# EAGLE design V2 (EAGLE 9.6.2)
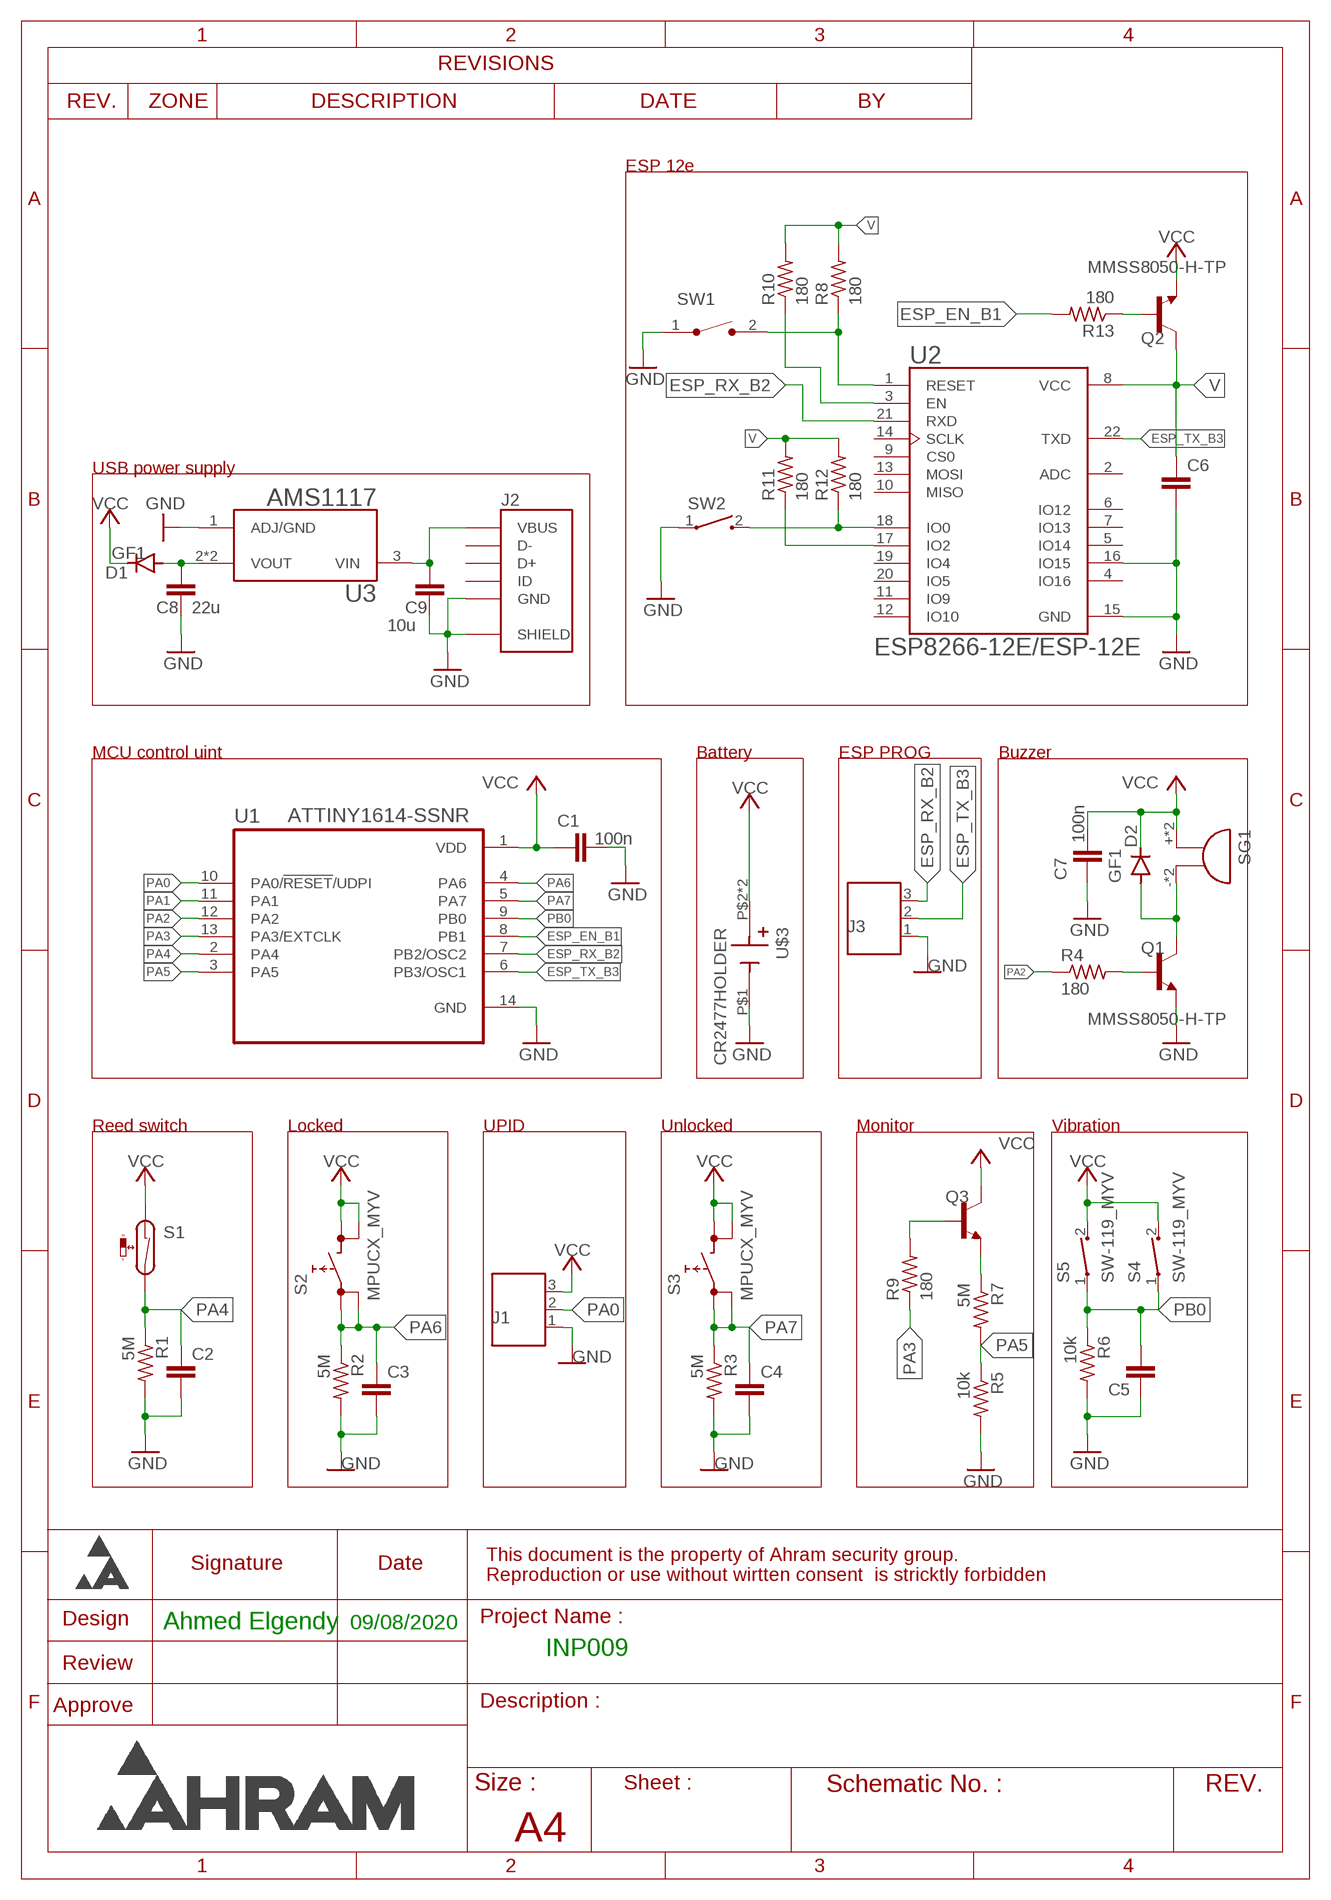
[diagram p0: schematic, sheet 1]

## Parts
C1  100n  C-EUC0805K  [C0805K]
C2  C-EUC0805K  [C0805K]
C3  C-EUC0805K  [C0805K]
C4  C-EUC0805K  [C0805K]
C5  C-EUC0805K  [C0805K]
C6  C-EUC0805K  [C0805K]
C7  100n  C-EUC0805K  [C0805K]
C8  22u  C-EUC0805K  [C0805K]
C9  10u  C-EUC0805K  [C0805K]
D1  GF1  [SMA-DO214AC]
D2  GF1  [SMA-DO214AC]
J1  691508110303  [691508110303]
J2  USB3065-XX-00-A_REVE  [GCT_USB3065-XX-00-A_REVE]
J3  691508110303  [691508110303]
Q1  MMSS8050-H-TP  [TRANS_MMSS8050-H-TP]
Q2  MMSS8050-H-TP  [TRANS_MMSS8050-H-TP]
Q3  MMSS8050-H-TP  [TRANS_MMSS8050-H-TP]
R1  5M  R-US_M0805  [M0805]
R2  5M  R-US_M0805  [M0805]
R3  5M  R-US_M0805  [M0805]
R4  180  R-US_M0805  [M0805]
R5  10k  R-US_M0805  [M0805]
R6  10k  R-US_M0805  [M0805]
R7  5M  R-US_M0805  [M0805]
R8  180  R-US_M0805  [M0805]
R9  180  R-US_M0805  [M0805]
R10  180  R-US_M0805  [M0805]
R11  180  R-US_M0805  [M0805]
R12  180  R-US_M0805  [M0805]
R13  180  R-US_M0805  [M0805]
S1  RI80SMDM-MYV  [RI80SMDM-0510-J1]
S2  MPUCX_MYV  [MPUCX_MYV]
S3  MPUCX_MYV  [MPUCX_MYV]
S4  SW-119_MYV  [SW-119]
S5  SW-119_MYV  [SW-119]
SG1  CMI-9653S-SMT  [SMD_BUZZER]
SW1  FSMSM  [TE_FSMSM]
SW2  1437566-3  [SW_1437566-3]
U1  ATTINY1614-SSNR  [SOIC127P600X175-14N]
U2  ESP8266-12E/ESP-12E  [XCVR_ESP8266-12E/ESP-12E]
U3  AMS1117  [SOT229P700X180-4N]
U$3  CR2477HOLDER  [CR2477]

## Nets
ESP_EN_B1 [dd]: R13.2 U1.8(PB1)
ESP_RX_B2 [dd]: J3.3 U1.7(PB2/OSC2) U2.21(RXD)
ESP_TX_B3 [dd]: J3.2 U1.6(PB3/OSC1) U2.22(TXD)
GND [dd]: C1.2 C2.2 C3.2 C4.2 C5.1 C6.2 C7.1 C8.1 C9.1 J1.1 J2.5(GND) J2.6(SHIELD) J2.7(SHIELD) J2.8(SHIELD) J2.9(SHIELD) J3.1 Q1.2(E) R1.2 R2.2 R3.2 R5.2 R6.2 SW1.1 SW2.1 U1.14(GND) U2.15(GND) U2.16(IO15) U3.1(ADJ/GND) U$3.P$1(-)
N$2 [dd]: D2.A Q1.3(C) SG1.- SG1.--(-)
N$3 [dd]: C9.2 J2.1(VBUS) U3.3(VIN)
N$4 [dd]: Q1.1(B) R4.2
N$5 [dd]: C8.2 D1.A U3.2(VOUT) U3.4(VOUT)
N$6 [dd]: Q3.1(B) R9.2
N$7 [dd]: Q2.1(B) R13.1
N$9 [dd]: R12.1 SW2.2 U2.18(IO0)
N$10 [dd]: R11.1 U2.17(IO2)
N$11 [dd]: R10.1 U2.3(EN)
N$12 [dd]: R8.1 SW1.2 U2.1(RESET)
NS3 [dd]: Q3.2(E) R7.1
PA0 [dd]: J1.2 U1.10(PA0/!RESET!/UDPI)
PA1 [dd]: U1.11(PA1)
PA2 [dd]: R4.1 U1.12(PA2)
PA3 [dd]: R9.1 U1.13(PA3/EXTCLK)
PA4 [dd]: C2.1 R1.1 S1.P$2 U1.2(PA4)
PA5 [dd]: R5.1 R7.2 U1.3(PA5)
PA6 [dd]: C3.1 R2.1 S2.1 S2.2 U1.4(PA6)
PA7 [dd]: C4.1 R3.1 S3.1 S3.2 U1.5(PA7)
PB0 [dd]: C5.2 R6.1 S4.1 S5.1 U1.9(PB0)
V [dd]: C6.1 Q2.3(C) R8.2 R10.2 R11.2 R12.2 U2.8(VCC)
VCC [dd]: C1.1 C7.2 D1.K(C) D2.K(C) J1.3 Q2.2(E) Q3.3(C) S1.P$1 S2.3 S2.4 S3.3 S3.4 S4.2 S5.2 SG1.+ SG1.++(+) U1.1(VDD) U$3.P$2(+) U$3.P$3(+)
Unconnected: J2.2(D-) J2.3(D+) J2.4(ID) U2.2(ADC) U2.4(IO16) U2.5(IO14) U2.6(IO12) U2.7(IO13) U2.9(CS0) U2.10(MISO) U2.11(IO9) U2.12(IO10) U2.13(MOSI) U2.14(SCLK) U2.19(IO4) U2.20(IO5)

## Notes on the sheet
- ESP 12e
- USB power supply
- MCU control uint | Battery | ESP PROG | Buzzer
- Reed switch | Locked | UPID | Unlocked | Monitor | Vibration
- Ahmed Elgendy | 09/08/2020
- INP009

## Library data of the parts
C1-C9 = rcl:C-EU: CAPACITOR, European symbol; SPICEPREFIX: C
D1 D2 = diode:GF1: DIODE
J1 J3 = Wurth_Elektronik_Electromechanic_Terminal_Blocks_Connectors_rev16b:691508110303: WR-TBL Terminal block - serie 5081 - 3 Pins;=>Code : Con_TBL_Screw_PClamp_3.50_6915081103xx_691508110303 <http://katalog.we-online.de/media/images/eican/Con_TBL_Screw_PClamp_3.50_6915081103xx_pf2.jpg> Details see: http://katalog.we-online.de/em/datasheet/6915081103xx.pdf Created 11/3/2014, Karrer Zheng 2014 (C) Wurth Elektronik
J2 = USB3065-XX-00-A_REVE:USB3065-XX-00-A_REVE: Micro USB Receptacle, Type B, 5 Pin, SMT, Horizontal, Bottom Mount (Standart), Optional Plastic Locating Peg; AVAILABILITY: Unavailable; DESCRIPTION: USB3065 Series 5 Pin, SMT, Horizontal, Bottom Mount, Micro USB Receptacle; MF: Global Connector Technology; MP: USB3065-30-00-A; PACKAGE: None; PRICE: None
Q1-Q3 = MMSS8050-H-TP:MMSS8050-H-TP: MMSS8050-H Series 25 V 1.5 A NPN Silicon Plastic-Encapsulate Transistor-SOT-23; AVAILABILITY: Unavailable; DESCRIPTION: Bipolar _BJT_ Transistor NPN 25V 1.5A 100MHz 625mW Surface Mount SOT-23; MF: Micro Commercial; MP: MMSS8050-H-TP; PACKAGE: SOT-23 Micro Commercial; PRICE: None
R1-R13 = rcl:R-US_: RESISTOR, American symbol; SPICEPREFIX: R
S1 = reed_MYV:RI80SMDM-MYV
S2 S3 = shouhan_BP:MPUCX_MYV
S4 S5 = sw-119_MYV:SW-119_MYV
SG1 = CUI audio device:CMI-9653S-SMT
SW1 = FSMSM:FSMSM: Switch Tactile OFF (ON) SPST Rectangular Button Gull Wing 0.05A 12VDC SMD Loose Piece Check prices <https://pricing.snapeda.com/parts/FSMSM/TE%20Connectivity/view-part?ref=eda>; AVAILABILITY: Warning; COMMENT: 1437566-3; CONFIGURATION_POLE-THROW: Single Pole - Single Throw; CONTACT_CURRENT_RATING: 50 mA; DESCRIPTION: Tactile Switch SPST-NO Top Actuated Surface Mount; MF: TE Connectivity; MP: FSMSM; PACKAGE: None; PRICE: None
SW2 = 1437566-3:1437566-3: Switch Tactile OFF (ON) SPST Rectangular Button Gull Wing 0.05A 12VDC SMD Loose Piece Check prices <https://pricing.snapeda.com/parts/1437566-3/TE%20Connectivity/view-part?ref=eda>; AVAILABILITY: Warning; COMMENT: 1437566-3; CONFIGURATION_POLE-THROW: Single Pole - Single Throw; CONTACT_CURRENT_RATING: 50 mA; DESCRIPTION: Tactile Switch SPST-NO Top Actuated Surface Mount; MF: TE Connectivity; MP: 1437566-3; PACKAGE: None; PRICE: None
U1 = ATTINY1614-SSNR:ATTINY1614-SSNR: 20MHz, SOIC, 85C, Green, 14 SOIC .150in T/R; ARROW_ELECTRONICS-PURCHASE-URL: https://snapeda.com/shop?store=Arrow+Electronics&id=4817174; AVAILABILITY: Unavailable; DESCRIPTION: IC MCU 8BIT 16KB FLASH 14SOIC; DIGIKEY-PURCHASE-URL: https://snapeda.com/shop?store=DigiKey&id=4817174; MF: Microchip Technology; MOUSER-PURCHASE-URL: https://snapeda.com/shop?store=Mouser&id=4817174; MP: ATTINY1614-SSNR; PACKAGE: None; PRICE: None
U2 = ESP8266-12E_ESP-12E:ESP8266-12E/ESP-12E: ESP-12E WiFi Module; AVAILABILITY: Unavailable; DESCRIPTION: This WiFi module has a 32-bit MCU micro and clock speeds supporting 80 MHz or 160 MHz. Supports the RTOS and integrated Wi-Fi MAC/BB/RF/PA/LNA, and has an on-board antenna.; MF: AI-Thinker; MP: ESP8266-12E/ESP-12E; PACKAGE: None; PRICE: None
U3 = AMS1117:AMS1117: Sot223/Pkg 1-Amp 5-Volt Low Drop Out Voltage Regulatator; AVAILABILITY: Unavailable; DESCRIPTION: UNO PLUS Arduino R3 Shield, Xbee Arduino IDE Wheeled Robotics Kit; MF: Seeed Technology; MP: AMS1117; PACKAGE: SOT-223 Seeed Technology; PRICE: None
U$3 = cr2477_MYV:CR2477HOLDER

## Net classes
0 default: width 0.254 mm, clearance 0.254 mm
1 dd: width 0.254 mm, clearance 0.254 mm

## Board
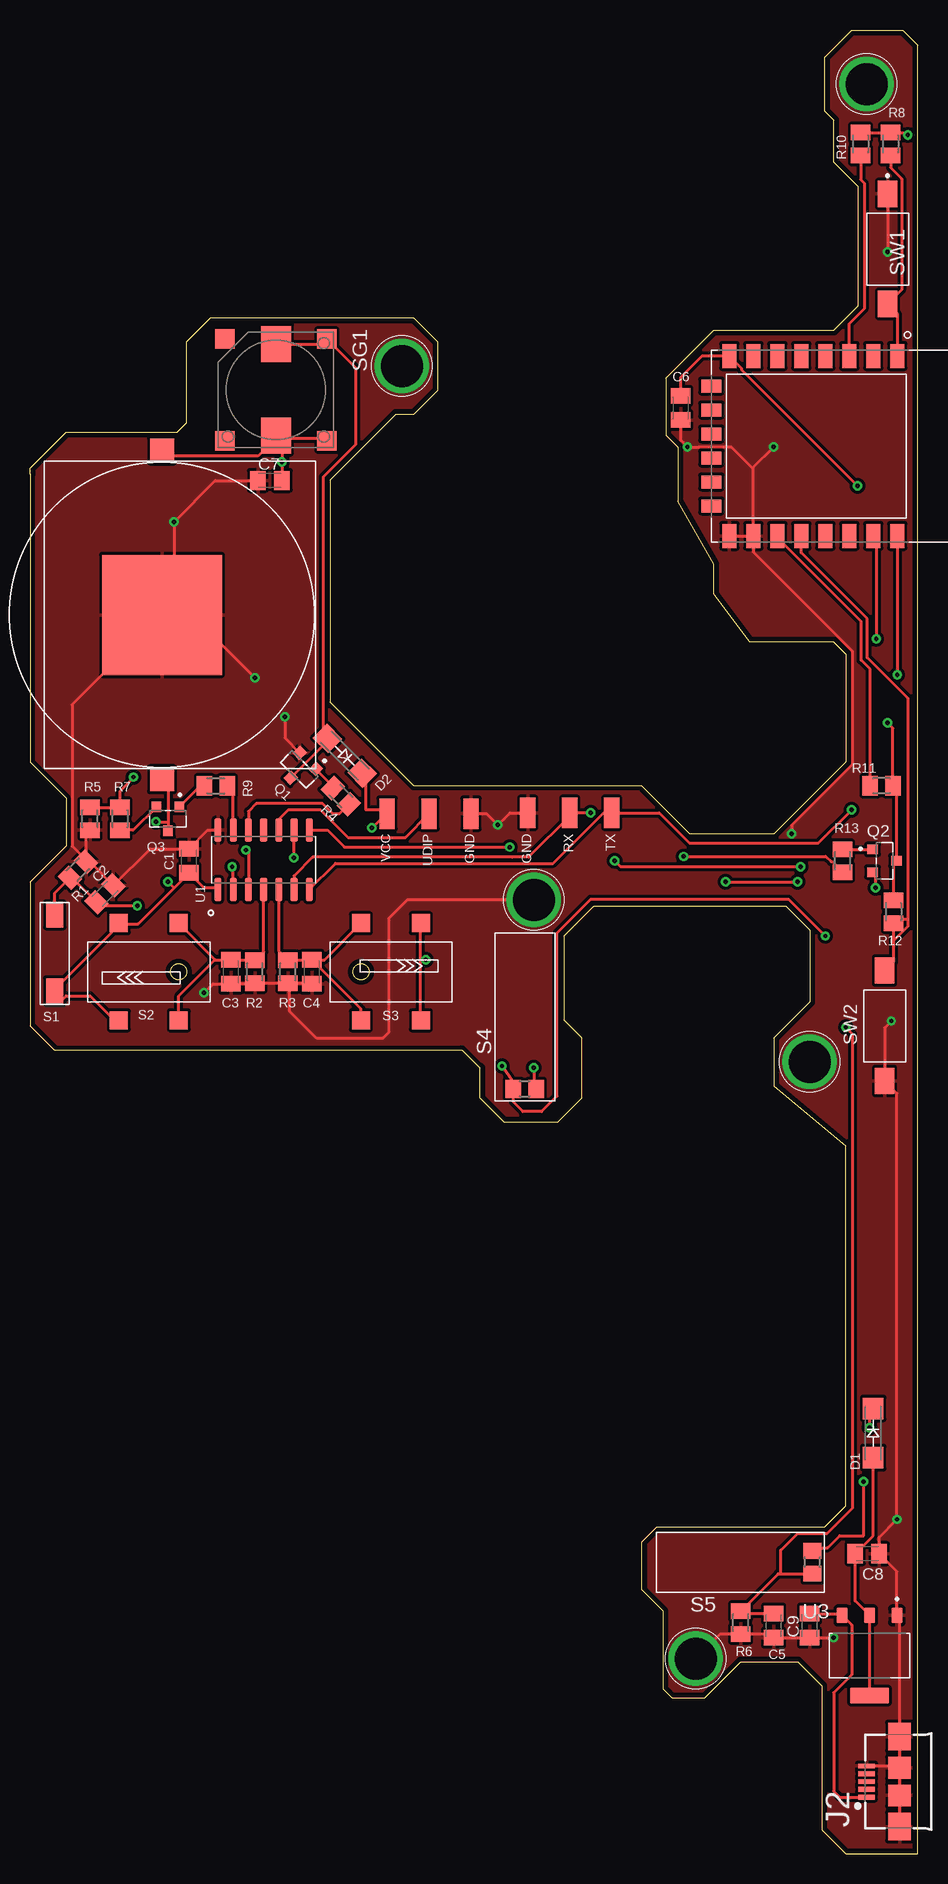
[diagram p1: board, top side]
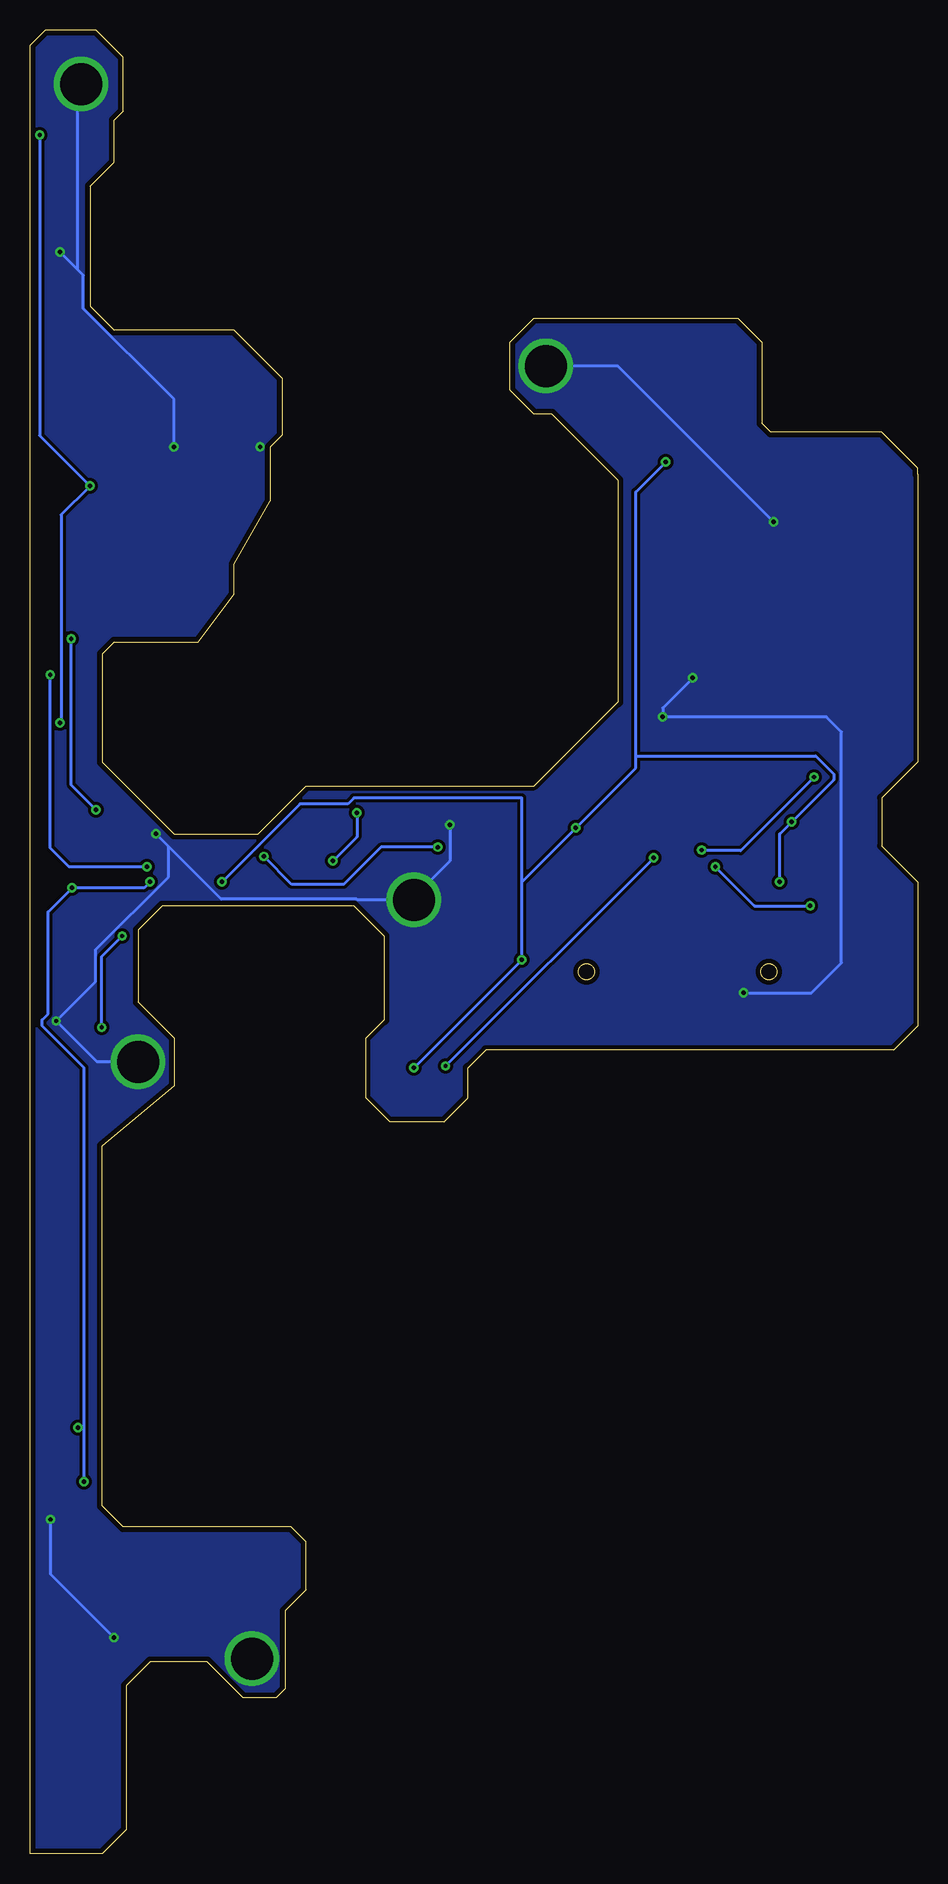
[diagram p2: board, bottom side, seen from below]

Size 74 x 152 mm. Coordinates in mm from the lower left corner, seen from the top.
Outline: 54,13 54.25,13
Outline: 54.25,13 53.5,13 52.75,13.75 52.75,20.25 51,22 51,26 52.25,27.25 66.25,27.25 68,29 68,59 62,64 62,68 65,71 65,77 63,79 47,79 44.5,76.5 44.5,69.5 46,68 46,63 44,61 39.5,61 37.5,63 37.5,65.5 36,67 2,67 0,69 0,81 3,84 3,88 0,91 0,115 0,115.5 3,118.5 12.25,118.5 13,119.25 13,126 15,128 32,128 34,126 34,122 32,120 30.5,120 25,114.5 25,96 32,89 51,89 55,85 62,85 68,91 68,100 67,101 60,101 57,105 57,107.5 54,112.75 54,117.25 53,118.25 53,123 57,127 67,127 69,129 69,139 67,141 67,144.5 66.25,145.25 66.25,149.75 68.5,152 72.75,152 74,150.75 74,0 68,0 66,2 66,14 64,16 59.25,16 56.25,13 54.25,13
Outline: circle at 12.4,73.5 radius 0.65
Outline: circle at 27.6,73.5 radius 0.65
Copper layers (1*16): Top 0.035mm / dielectric 1.5mm / Bottom 0.035mm
Design rules "default *": minimum track width 10mil, minimum drill 0.35mm, track to track 10mil, track to pad 10mil, pad to pad 10mil, via to via 10mil, smd to smd 10mil, copper to edge 15mil, drill to drill 10mil, minimum pad ring 10mil, minimum via ring 8mil, stop-mask expansion 4mil, vias tented up to drill 0mil, thermal gap 10mil

### Footprints (pad centres in the part's own frame; a part is rotated, then mirrored left to right if it is on the bottom)
C0805K = smd 1.3 x 1.6: 1 -1,0; 2 1,0
SMA-DO214AC = smd 1.8 x 1.7: A -2.05,0; K 2.05,0
691508110303 = smd 1.27 x 2.54: 1 -3.5,0; 2 0,0; 3 3.5,0
GCT_USB3065-XX-00-A_REVE = smd 0.4 x 1.4: 1 -1.3,0.5; 2 -0.65,0.5; 3 0,0.5; 4 0.65,0.5; 5 1.3,0.5 | smd 1.8 x 1.9: 6 1.15,-2.25; 7 -1.15,-2.25 | smd 2.3 x 1.9: 8 3.75,-2.25; 9 -3.75,-2.25
TRANS_MMSS8050-H-TP = smd 0.9 x 0.8: 1 -1,0.95; 2 -1,-0.95; 3 1,0
M0805 = smd 1.3 x 1.6: 1 -0.95,0; 2 0.95,0
RI80SMDM-0510-J1 = smd 2.1 x 1.45: P$1 -3,0; P$2 3.35,0
MPUCX_MYV = smd 1.5 x 1.5: 1 0.1,1.55; 2 0.1,-6.55; 3 5.1,1.55; 4 5.1,-6.55
SW-119 = smd 1.3 x 1.5: 1 -0.95,0; 2 0.95,0
SMD_BUZZER = smd 3 x 2.5: + 3.8,0; - -3.8,0 | smd 1.6 x 1.6: ++ 4.25,4.25; -- -4.25,4.25; N 4.25,-4.25; NC -4.25,-4.25
TE_FSMSM = smd 2.19 x 1.6: 1 -4.59,0; 2 4.59,0
SW_1437566-3 = smd 2.18 x 1.6: 1 -4.6,0; 2 4.6,0
SOIC127P600X175-14N = smd 1.95 x 0.59: 1 -2.48,3.81; 2 -2.48,2.54; 3 -2.48,1.27; 4 -2.48,0; 5 -2.48,-1.27; 6 -2.48,-2.54; 7 -2.48,-3.81; 8 2.48,-3.81; 9 2.48,-2.54; 10 2.48,-1.27; 11 2.48,0; 12 2.48,1.27; 13 2.48,2.54; 14 2.48,3.81
XCVR_ESP8266-12E/ESP-12E = smd 2 x 1.2: 1 -7.5,7; 2 -7.5,5; 3 -7.5,3; 4 -7.5,1; 5 -7.5,-1; 6 -7.5,-3; 7 -7.5,-5; 8 -7.5,-7; 15 7.5,-7; 16 7.5,-5; 17 7.5,-3; 18 7.5,-1; 19 7.5,1; 20 7.5,3; 21 7.5,5; 22 7.5,7 | smd 1.1 x 1.7: 9 -5,-8.5; 10 -3,-8.5; 11 -1,-8.5; 12 1,-8.5; 13 3,-8.5; 14 5,-8.5
SOT229P700X180-4N = smd 1.31 x 0.93: 1 -3.345,2.29; 2 -3.345,0; 3 -3.345,-2.29 | smd 1.31 x 3.24: 4 3.345,0
CR2477 = smd 10 x 10: P$1 0,0 | smd 2 x 2: P$2 13.7,0; P$3 -13.7,0

### Placement (x,y rotation side)
C1  13.25,82.75 90 top
C2  6.25,80 45 top
C3  16.75,73.5 270 top
C4  23.5,73.5 270 top
C5  62,19 90 top
C6  54.25,120.5 270 top
C7  20,114.45 0 top
C8  69.8,25 180 top
C9  65,19 90 top
D1  70.3,35.05 90 top
D2  26.25,91.5 315 top
J1  33.28,86.68 180 top
J2  70.25,6 90 top
J3  45,86.75 0 top
Q1  22.45,90.37 225 top
Q2  71.25,82.75 0 top
Q3  11.5,86.25 270 top
R1  4,82 45 top
R2  18.75,73.5 270 top
R3  21.5,73.5 270 top
R4  25.92,88.14 135 top
R5  5,86.25 270 top
R6  59.25,19.25 270 top
R7  7.5,86.25 90 top
R8  71.75,142.5 90 top
R9  15.5,89 180 top
R10  69.25,142.5 90 top
R11  71,89 0 top
R12  72,78.5 90 top
R13  67.75,82.75 270 top
S1  2.06,74.89 90 top
S2  12.5,71 180 top
S3  27.5,76 0 top
S4  41.25,63.75 0 top
S5  65.23,24.28 90 top
SG1  20.5,122 270 top
SW1  71.5,133.75 270 top
SW2  71.25,69 90 top
U1  19.48,82.83 90 top
U2  65.31,117.32 270 top
U3  70,16.5 270 top
U$3  11,103.25 90 top

### Tracks (layer width: path | path; a pad name or v marks a point on that pad's centre or on a via)
ESP_EN_B1  (via drill 0.35)
  Top 0.254: U1.8 24.79,85.31 26.22,83.88 v40,83.88 | R13.2 66.88,82.67 66.79,82.67 66.34,83.12 v54.5,83.12
  Bottom 0.254: v40,83.88 44.75,83.88 47.84,80.79 52.17,80.79 v54.5,83.12
ESP_RX_B2  (via drill 0.35)
  Top 0.254: v68.5,87 65.74,84.24 54.97,84.24 52.46,86.75 J3.3 47.82,86.75 43.61,82.53 25.47,82.53 U1.7 | U2.21 70.56,109.57 v70.56,101.25
  Bottom 0.254: v68.5,87 70.56,89.06 v70.56,101.25
ESP_TX_B3  (via drill 0.35)
  Top 0.254: U2.22 v72.31,98.25 | v64.25,82.25 49.25,82.25 v48.75,82.75 | v46.75,86.75 J3.2 45,86.48 41.58,83.06 40.2,83.06 40.19,83.04 23.56,83.04 22.02,81.5 U1.6
  Bottom 0.254: v72.31,98.25 72.31,83.81 70.75,82.25 v64.25,82.25 | v46.75,86.75 46.75,84.75 v48.75,82.75
GND  (via drill 0.35, 3.5)
  Top 0.254: J2.9 J2.7 J2.6 | v55.5,16.25 57.55,18.3 R6.2 61.7,18.3 C5.1 C9.1 v67,18 | SW2.1 72.29,63.36 v72.29,27.85 70.81,26.37 70.81,26.29 70.8,26.28 C8.1 72.29,23.51 U3.1 72.5,19.64 J2.8 J2.6 | SW2.1 | v71.81,69.4 71.25,68.83 SW2.1 | U2.16 60.31,108.48 68.56,100.23 68.56,90.77 63.5,85.71 v63.5,85 | U2.15 U2.16 | U2.16 60.31,115.4 | 60.31,115.4 60.31,115.56 v62,117.25 | C6.2 54.25,117.81 v54.81,117.25 55.8,117.25 55.8,117.26 58.46,117.26 60.31,115.4 | SW1.1 v71.5,133.5 | J1.1 38.07,86.68 v39,85.75 40,86.75 J3.1 | v14.5,71.75 15.25,72.5 C3.2 18.7,72.5 R2.2 R3.2 21.65,72.55 | 21.65,72.55 23.45,72.55 C4.2 | C7.1 15.45,114.45 v12,111 12,104.25 U$3.P$1 | U$3.P$1 13.5,103.25 v18.75,98 | U$3.P$1 3.51,95.76 3.51,83.96 4.8,82.67 | U1.14 14.81,85.31 C1.2 10,83.75 C2.2 4.99,82.67 4.8,82.67 | v21.25,94.75 21.25,92.98 Q1.2 | J2.5 72.35,7.3 J2.6 | v42,79.5 31.45,79.5 29.9,77.95 29.9,68.45 29.4,67.95 23.9,67.95 21.65,70.2 21.65,72.55 | R5.2 4.67,84.97 R1.2 4.8,82.67
  Bottom 0.254: v67,18 72.29,23.29 v72.29,27.85 | v65,66 68.41,66 v71.81,69.4 68.53,72.68 68.53,75.34 62.45,81.41 62.45,83.95 | 62.45,83.95 v63.5,85 | 70.05,132.05 69.56,131.56 69.56,128.77 62,121.21 v62,117.25 | 70.05,132.05 v71.5,133.5 | v69.75,147.5 70.05,147.2 70.05,132.05 | v39,85.75 39,82.75 42,79.75 v42,79.5 46.71,79.5 46.77,79.56 58.06,79.56 62.45,83.95 | v12,111 25,124 v31,124 | v18.75,98 21.25,95.5 v21.25,94.75 7.6,94.75 6.35,93.5 6.35,74.25 8.85,71.75 v14.5,71.75
  pour Top: 74,152 74,0 0,0 0,150 0,152
  pour Bottom: 74,152 74,0 2,0 0,0 0,137 0,152
N$2
  Top 0.254: SG1.- 24.3,125.8 SG1.-- 27.15,123.85 27.15,117.44 24.44,114.73 24.44,93.31 D2.A 24.8,92.72 Q1.3
N$3
  Top 0.254: C9.2 67.56,20 U3.3 68.5,19.06 68.5,14.9 67,13.4 67,5.2 67.5,4.7 J2.1
N$4
  Top 0.254: Q1.1 25.25,88.99 R4.2
N$5
  Top 0.254: U3.4 U3.2 68.8,21.05 C8.2 70.3,26.5 D1.A
N$6
  Top 0.254: Q3.1 14.2,89 R9.2
N$7
  Top 0.254: R13.1 Q2.1
N$9
  Top 0.254: SW2.2 72,74.35 72,76.09 | 72,76.09 R12.1 72.33,77.88 73.21,77.88 | U2.18 64.31,108.42 69.8,102.93 69.8,99.69 73.21,96.28 73.21,77.88 | 72,76.09 73.21,77.29 73.21,77.88
N$10
  Top 0.254: R11.1 70.05,98.72 69.29,99.47 69.29,102.7 62.31,109.69 U2.17
N$11
  Top 0.254: R10.1 69.25,139.54 69.56,139.23 69.56,128.77 68.31,127.52 U2.3
N$12
  Top 0.254: U2.1 72.31,128.35 SW1.2 72.68,130.34 72.68,139.59 71.75,140.52 R8.1
NS3
  Top 0.254: Q3.2 8.6,85.3 R7.1
PA0
  Top 0.254: U1.10 20.75,86.21 21.55,87.01 24.19,87.01 26.5,84.7 31.3,84.7 J1.2
PA2
  Top 0.254: R4.1 25.77,86.65 25.27,86.65 24.4,87.52 18.87,87.52 18.21,86.86 U1.12
PA3
  Top 0.254: U1.13 16.94,88.51 R9.1
PA4  (via drill 0.35)
  Top 0.254: S1.P$2 2.06,80.06 R1.1 3.51,81.33 C2.1 5.84,79 v8.95,79 | U1.2 16.94,82.16 v16.85,82.25
  Bottom 0.254: v16.85,82.25 13.6,79 v8.95,79
PA5  (via drill 0.35)
  Top 0.254: R5.1 R7.2 7.5,88.55 8.65,89.7 v8.62,89.72 | v18,83.65 18.21,83.44 U1.3
  Bottom 0.254: v8.62,89.72 14.75,83.6 18,83.6 v18,83.65
PA6
  Top 0.254: S2.1 12.4,71.5 15.4,74.5 C3.1 | S2.2 15.45,74.5 C3.1 | C3.1 18.7,74.5 R2.1 19.48,75.18 U1.4
PA7
  Top 0.254: U1.5 20.75,75.2 R3.1 21.55,74.5 C4.1 | C4.1 24.55,74.5 S3.1 | S3.2 27.6,70.4 C4.1
PB0  (via drill 0.35)
  Top 0.254: C5.2 59.45,20 R6.1 62.38,23.33 62.6,23.33 | 62.6,23.33 S5.1 | 62.6,23.33 62.6,25.29 64,26.69 66.48,26.69 68.6,28.81 68.6,68.29 v68.02,68.87 | v66.3,76.49 63.23,79.56 46.77,79.56 43.94,76.73 43.94,63.14 42.65,61.85 41.1,61.85 40.3,62.65 S4.1 40.3,64.27 v39.35,65.65 | v22,83 22,85 U1.9
  Bottom 0.254: v68.02,68.87 68.02,74.78 v66.31,76.49 v66.3,76.49 | v39.35,65.65 v22,83
V  (via drill 0.35)
  Top 0.254: R12.2 72,82.5 Q2.3 72.25,88.7 R11.2 71.95,93.8 v71.5,94.25 | C6.1 54.25,123.05 56.05,124.85 58.28,124.85 U2.8 59.33,123.81 59.33,123.67 59.55,123.44 59.56,123.44 v69,114 | R10.2 R8.2 72.99,143.45 v73.19,143.25
  Bottom 0.254: v71.5,94.25 71.41,94.34 71.41,111.59 v69,114 73.19,118.19 v73.19,143.25
VCC  (via drill 0.35)
  Top 0.254: v70.5,80.5 70.5,81.5 Q2.2 | v69.5,31 69.5,26.5 67.5,26.5 66.5,25.5 65.5,25.5 S5.2 | v70,35.5 70,37 D1.K | 11.5,86 11.5,89.5 11,89.5 U$3.P$3 | 11.5,86 Q3.3 | U1.1 15.5,80.5 14.5,80.5 C1.1 12,80.5 | S2.3 7,69.5 5,71.5 3,71.5 2.5,71 2,71.5 S1.P$1 2,72 7,77 7,77.5 S2.4 7.5,77.5 9,77.5 12,80.5 | v10.5,86 11.5,86 | 12,80.5 v11.5,81 | 21,118 v21,116 C7.2 | 20.5,118 21,118 | 21,118 24.5,118 SG1.++ | 21,118 SG1.+ 20.5,118 | 20.5,118 19,116.5 11,116.5 U$3.P$2 | D2.K 28,90 28,87 29.5,87 J1.3 29.5,86.5 v28.5,85.5 | 32.5,74.5 32.5,77.5 S3.3 | 32.5,74.5 32.5,69.5 S3.4 | v42,65.5 42,64 S4.2 | 32.5,74.5 v33,74.5 | v58,81 v64,81
  Bottom 0.254: v69.5,31 69.5,35.5 | 69.5,35.5 69.5,65.5 73,69 73,69.5 72.5,70 72.5,78.5 v70.5,80.5 64.5,80.5 v64,81 | 69.5,35.5 v70,35.5 | v11.5,81 11.5,85 v10.5,86 7,89.5 7,90 8.5,91.5 23.5,91.5 | v42,65.5 v33,74.5 33,81 | 33,81 v28.5,85.5 23.5,90.5 23.5,91.5 | v21,116 23.5,113.5 23.5,91.5 | v58,81 51.5,87.5 47.5,87.5 47,88 33,88 33,81

### Text on the board
tNames: VCC | UDIP | GND | GND | RX | TX